# EAGLE schematic JDM2_w_MOSFET_2 (EAGLE 7.7.0)
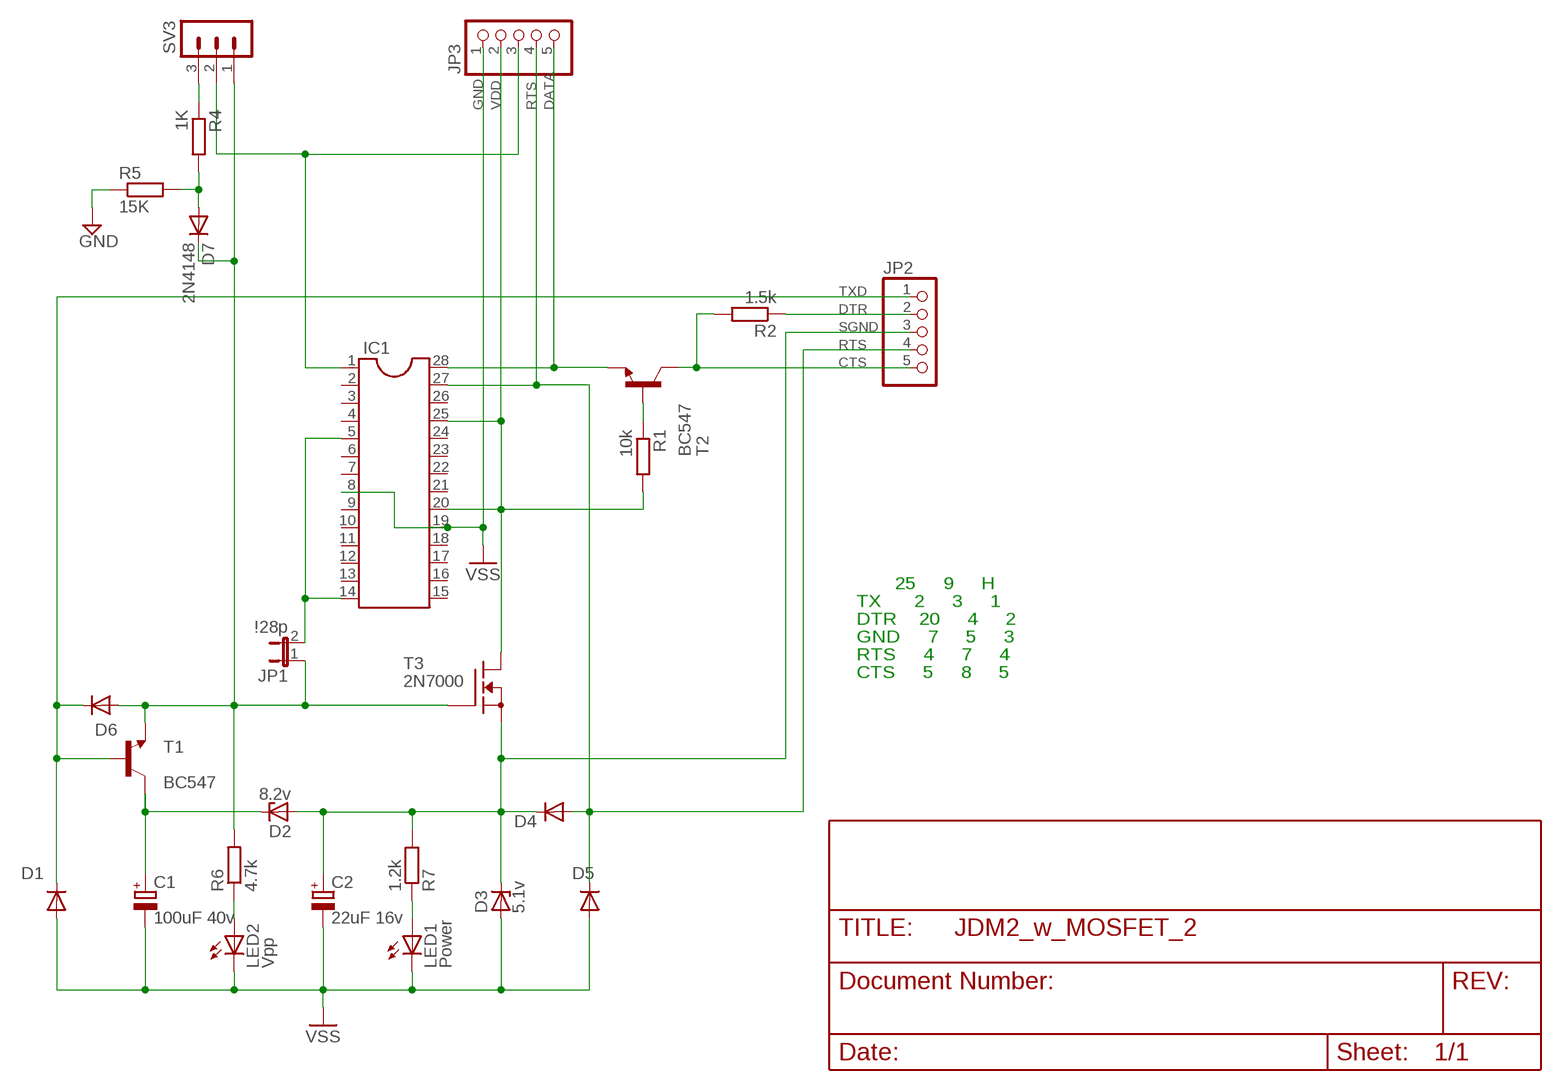
[diagram p0: schematic, sheet 1]

## Parts
C1  100uF 40v  CPOL-EUE2.5-6  [E2,5-6]
C2  22uF 16v  CPOL-EUE2.5-6  [E2,5-6]
D1  1N4148  2N41487  [DO35-7]
D2  8.2v  Z-DIODEZ7  [DO35Z7]
D3  5.1v  Z-DIODEZ7  [DO35Z7]
D4  1N4148  2N41485  [DO35-5]
D5  1N4148  2N41485  [DO35-5]
D6  1N4148  2N41485  [DO35-5]
D7  2N4148  2N41485  [DO35-5]
IC1  DIL28-3  [DIL28-3]
JP1  \!28p  JP1E  [JP1]
JP2  PINHD-1X5  [1X05]
JP3  PINHD-1X5  [1X05]
LED1  Power  LED  [LED5MM]
LED2  Vpp  LED  [LED5MM]
R1  10k  R-EU_0204/7  [0204/7]
R2  1.5k  R-EU_0204/7  [0204/7]
R4  1K  R-EU_0204/7  [0204/7]
R5  15K  R-EU_0204/5  [0204/5]
R6  4.7k  R-EU_0204/7  [0204/7]
R7  1.2k  R-EU_0204/7  [0204/7]
SV3  MA03-1  [MA03-1]
T1  BC547  [TO92-CBE]
T2  BC547  [TO92-CBE]
T3  2N7000  [TO92]

## Nets
2N3904: C1.+ D2.C T1.C
CTS: JP2.5 R2.2 T2.C
DATA: IC1.28 JP3.5 T2.E
DTR: JP2.2 R2.1
GND: C1.- C2.- D1.A D3.A D5.A IC1.8 IC1.19 JP3.1 LED1.K(C) LED2.K(C) R5.1 ; supply symbol labelled VSS
MCLR: IC1.1 JP3.3 SV3.2
N$1: R1.1 T2.B
N$2: LED1.A R7.1
N$3: LED2.A R6.1
N$7: IC1.5 IC1.14 JP1.2
N$9: R4.1 SV3.3
N$10: D7.A R4.2 R5.2
RTS: D4.A D5.C IC1.27 JP2.4 JP3.4
SGND: C2.+ D2.A D3.C D4.C JP2.3 R7.2 T3.1(S)
TXD: D1.C D6.C JP2.1 T1.B
VDD: IC1.20 IC1.25 JP3.2 R1.2 T3.3(D)
VPP: D6.A D7.C JP1.1 R6.2 SV3.1 T1.E T3.2(G)
Unconnected: IC1.2 IC1.3 IC1.4 IC1.6 IC1.7 IC1.9 IC1.10 IC1.11 IC1.12 IC1.13 IC1.15 IC1.16 IC1.17 IC1.18 IC1.21 IC1.22 IC1.23 IC1.24 IC1.26

## Notes on the sheet
- 25     9     H
- TX      2     3     1
- DTR    20     4     2
- GND     7     5     3
- RTS     4     7     4
- CTS     5     8     5

## Library data of the parts
C1 C2 = rcl:CPOL-EU: POLARIZED CAPACITOR, European symbol
D1 D4-D7 = JDM2:2N4148
D2 D3 = JDM2:Z-DIODE
IC1 = ic-package:DIL28: Dual In Line
JP1 = jumper:JP1E: JUMPER
JP2 JP3 = pinhead:PINHD-1X5: PIN HEADER
LED1 LED2 = 1dmf:LED
R1 R2 R4-R7 = rcl:R-EU_: RESISTOR, European symbol
SV3 = con-lstb:MA03-1: PIN HEADER; OC_FARNELL: unknown; OC_NEWARK: unknown
T1 T2 = JDM2:BC547
T3 = JDM2:2N7000

## Net classes
0 default: width 0.559 mm
1 power: width 0.559 mm